# Altium schematic sheet Cover.SchDoc
size A4; Date: 22.07.2025; CheckedBy: Own Checked; Author: A4; CompanyName: No Company; DocumentNumber: ELK.PCB.0001.0001.A.A; Revision: V0.0.1; SheetNumber: 1; SheetTotal: 5
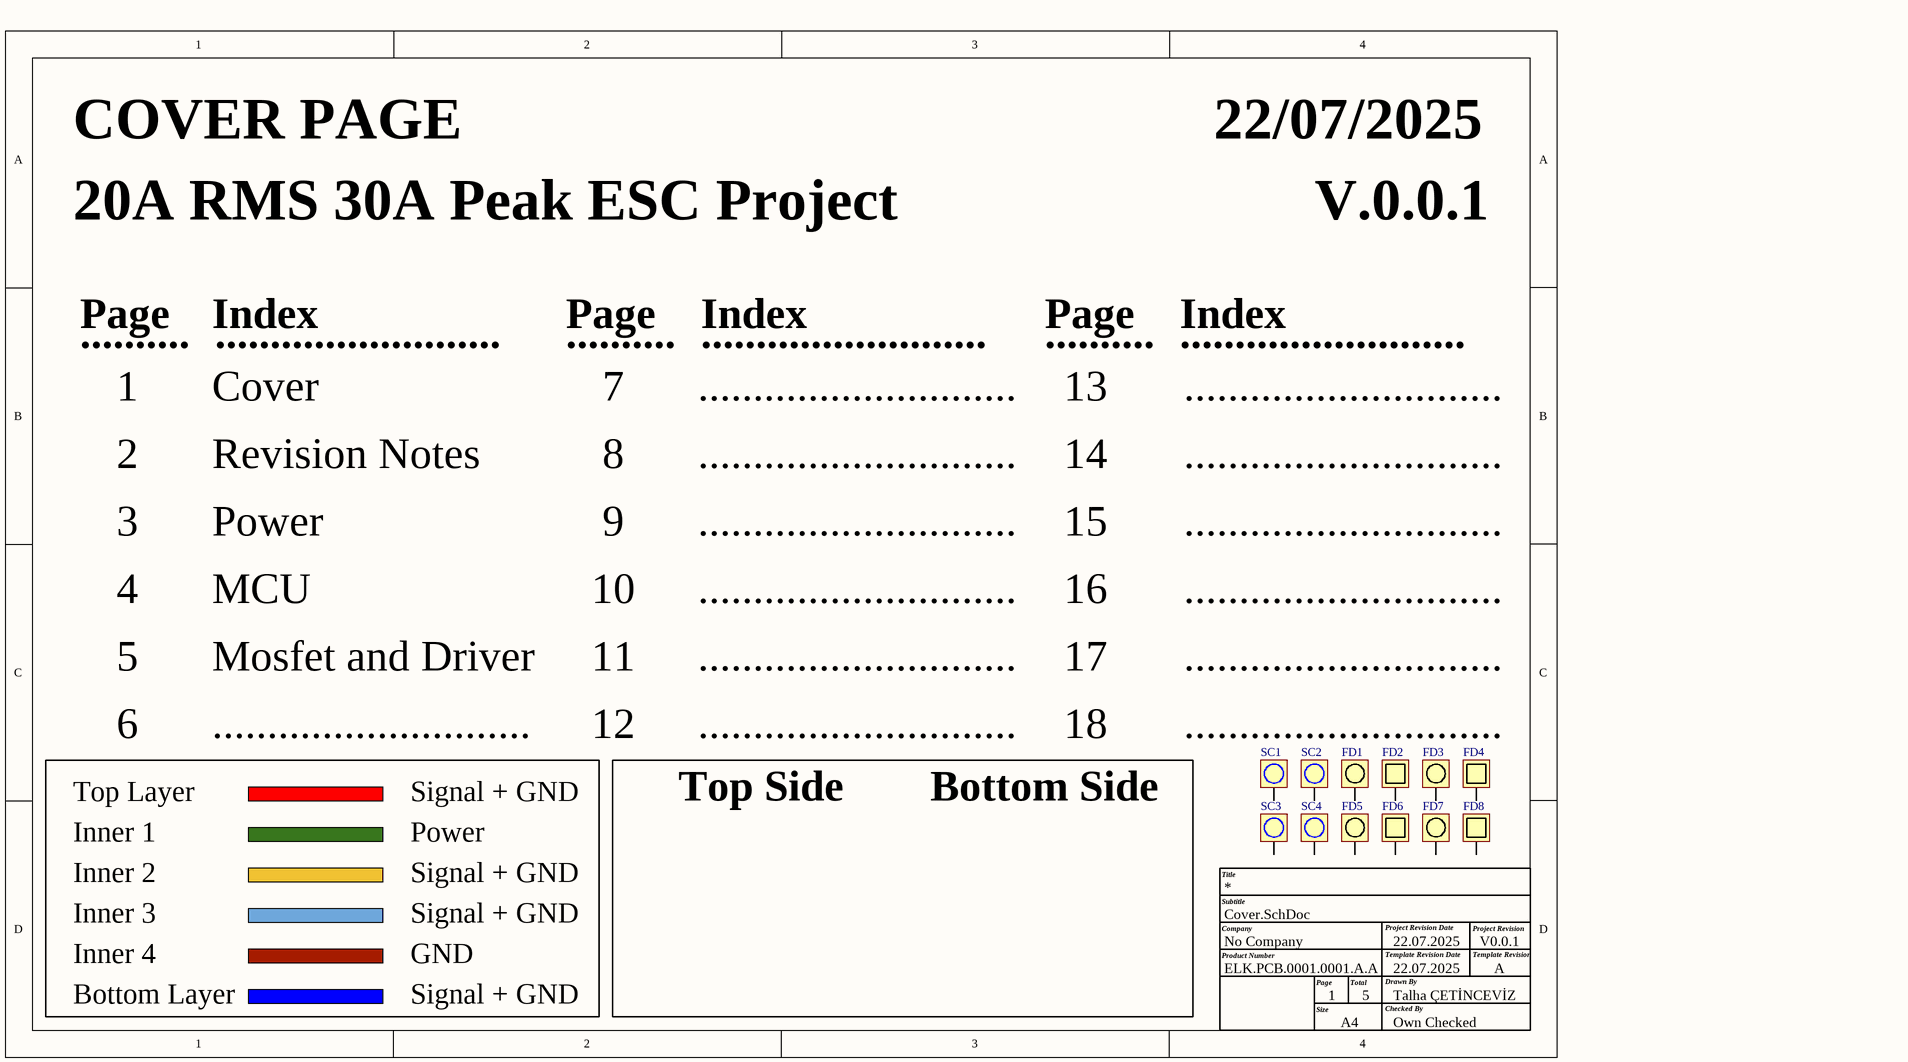
[diagram p0: Cover.SchDoc]

## Parts
FD1  Fidicual_Rounded  [FD Rounded]  (value not drawn)  (no BOM)
FD2  Fidicual_Square  [FD Square]  (value not drawn)  (no BOM)
FD3  Fidicual_Rounded  [FD Rounded]  (value not drawn)  (no BOM)
FD4  Fidicual_Square  [FD Square]  (value not drawn)  (no BOM)
FD5  Fidicual_Rounded  [FD Rounded]  (value not drawn)  (no BOM)
FD6  Fidicual_Square  [FD Square]  (value not drawn)  (no BOM)
FD7  Fidicual_Rounded  [FD Rounded]  (value not drawn)  (no BOM)
FD8  Fidicual_Square  [FD Square]  (value not drawn)  (no BOM)
SC1  Screw_M3  [SCREW M3]  (value not drawn)  (no BOM)
SC2  Screw_M3  [SCREW M3]  (value not drawn)  (no BOM)
SC3  Screw_M3  [SCREW M3]  (value not drawn)  (no BOM)
SC4  Screw_M3  [SCREW M3]  (value not drawn)  (no BOM)

## Nets

Not connected (* = marked no-connect by the designer): FD1 1; FD2 1; FD3 1; FD4 1; FD5 1; FD6 1; FD7 1; FD8 1; SC1 1; SC2 1; SC3 1; SC4 1

## Notes on the sheet
- COVER PAGE
- 22/07/2025
- 20A RMS 30A Peak ESC Project
- V.0.0.1
- Page
- ..........
- Index
- ..........................
- 1
- Cover
- 7
- .............................
- 13
- 2
- Revision Notes
- 8
- 14
- 3
- Power
- 9
- 15
- 4
- MCU
- 10
- 16
- 5
- Mosfet and Driver
- 11
- 17
- 6
- 12
- 18
- Top Layer
- Inner 1
- Signal + GND
- Top Side
- Bottom Side
- Inner 2
- Inner 3
- Inner 4
- GND
- Bottom Layer
- Title
- Company
- Product Number
- Subtitle
- Project Revision Date
- Template Revision Date
- Project Revision
- Template Revision
- Size
- A4
- Total
- Checked By
- Drawn By
- 22.07.2025
- Talha ÇETİNCEVİZ
- A

## Library data of the parts
SC1-SC4 = Screw_M3: Screw hole Metric 3